# EAGLE design final (EAGLE 7.6.0)
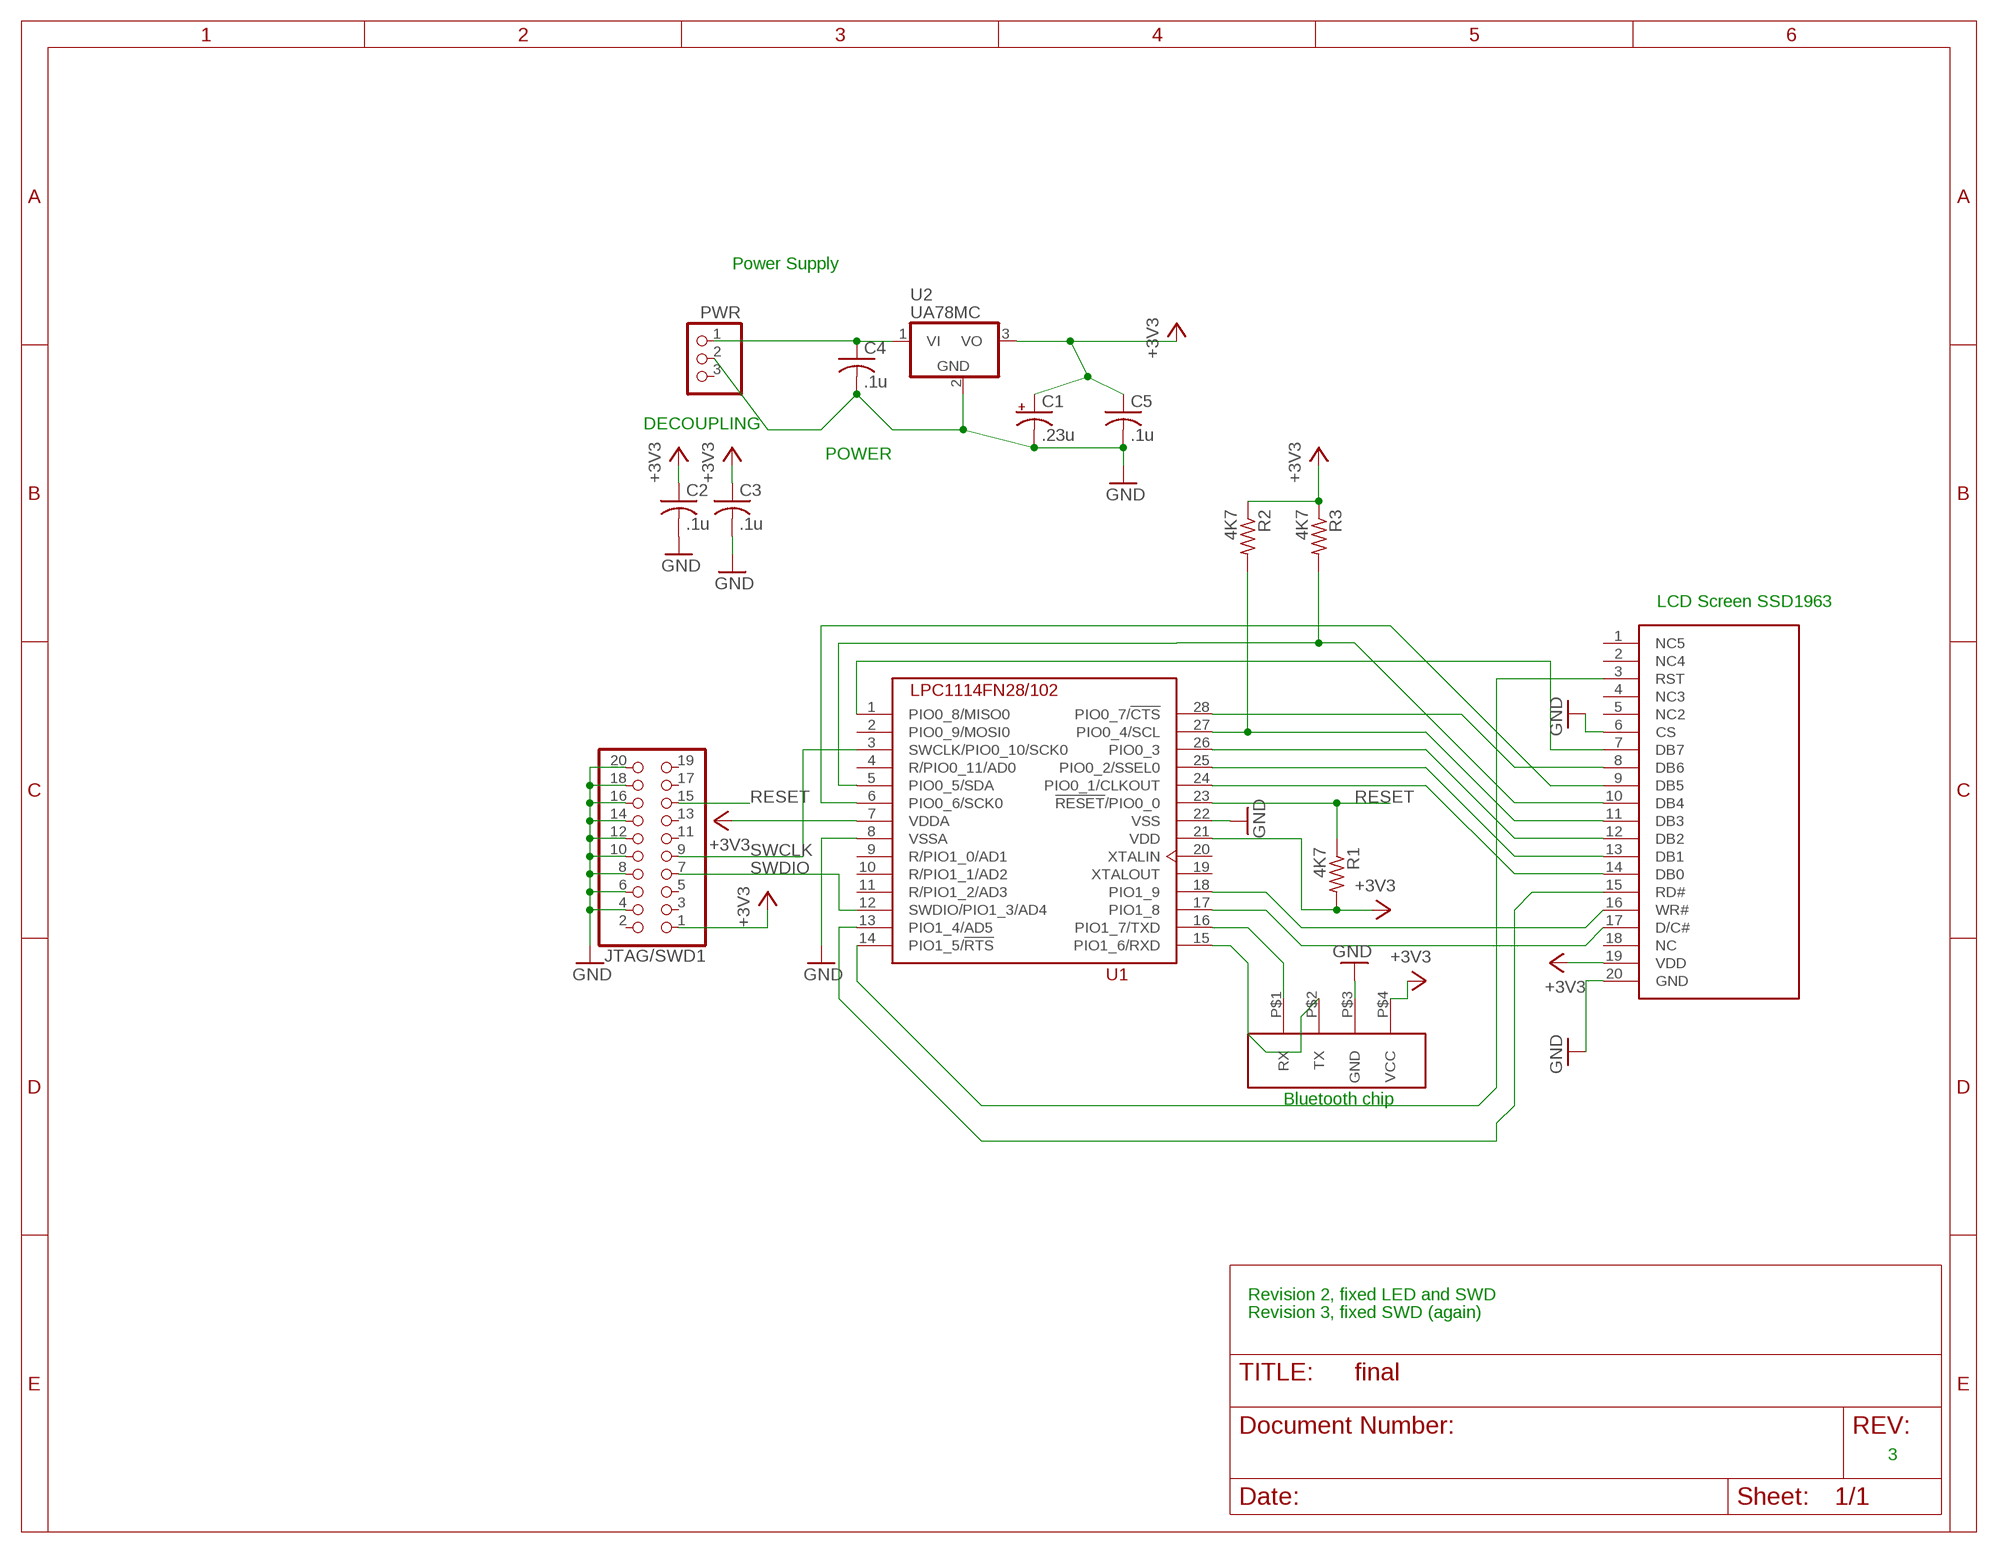
[diagram p0: schematic, sheet 1]

## Parts
C1  .23u  CPOL-USE3.5-8  [E3,5-8]
C2  .1u  C-US050-024X044  [C050-024X044]
C3  .1u  C-US050-024X044  [C050-024X044]
C4  .1u  C-US050-024X044  [C050-024X044]
C5  .1u  C-US050-024X044  [C050-024X044]
JTAG/SWD1  PINHD-2X10  [2X10]
PWR  PINHD-1X3  [1X03]
R1  4K7  R-US_0207/10  [0207/10]
R2  4K7  R-US_0207/10  [0207/10]
R3  4K7  R-US_0207/10  [0207/10]
U1  LPC1114FN28/102  [DIL28-6]
U2  UA78MC  [TO220V]
U$1  BLUETOOTH  [BLUETOOTH]
U$2  LCD_TOUCH  [NHD-7.0-800480WF]

## Nets
+3V3: C1.+ C2.1 C3.1 C5.1 JTAG/SWD1.1 R1.2 R2.1 R3.1 U1.7(VDDA) U1.21(VDD) U2.3(VO) U$1.P$4(VCC) U$2.19(VDD)
GND: C1.- C2.2 C3.2 C4.2 C5.2 JTAG/SWD1.4 JTAG/SWD1.6 JTAG/SWD1.8 JTAG/SWD1.10 JTAG/SWD1.12 JTAG/SWD1.14 JTAG/SWD1.16 JTAG/SWD1.18 JTAG/SWD1.20 PWR.2 U1.8(VSSA) U1.22(VSS) U2.2(GND) U$1.P$3(GND) U$2.6(CS) U$2.20(GND)
N$1: U1.5(PIO0_5/SDA)
N$2: C4.1 PWR.1 U2.1(VI)
N$3: U1.6(PIO0_6/SCK0) U$2.9(DB5)
N$4: U1.1(PIO0_8/MISO0) U$2.7(DB7)
N$5: U1.16(PIO1_7/TXD) U$1.P$1(RX)
N$6: U1.13(PIO1_4/AD5) U$2.15(RD#)
N$7: U1.15(PIO1_6/RXD) U$1.P$2(TX)
N$8: R3.2 U$2.10(DB4)
N$9: R2.2 U1.27(PIO0_4/SCL) U$2.11(DB3)
N$10: U1.26(PIO0_3) U$2.12(DB2)
N$11: U1.25(PIO0_2/SSEL0) U$2.13(DB1)
N$12: U1.24(PIO0_1/CLKOUT) U$2.14(DB0)
N$13: U1.28(PIO0_7/!CTS) U$2.8(DB6)
N$14: U1.14(PIO1_5/!RTS) U$2.3(RST)
N$17: U1.17(PIO1_8) U$2.17(D/C#)
N$18: U1.18(PIO1_9) U$2.16(WR#)
RESET: JTAG/SWD1.15 R1.1 U1.23(!RESET!/PIO0_0)
SWCLK: JTAG/SWD1.9 U1.3(SWCLK/PIO0_10/SCK0)
SWDIO: JTAG/SWD1.7 U1.12(SWDIO/PIO1_3/AD4)
Unconnected: JTAG/SWD1.2 JTAG/SWD1.3 JTAG/SWD1.5 JTAG/SWD1.11 JTAG/SWD1.13 JTAG/SWD1.17 JTAG/SWD1.19 PWR.3 U1.2(PIO0_9/MOSI0) U1.4(R/PIO0_11/AD0) U1.9(R/PIO1_0/AD1) U1.10(R/PIO1_1/AD2) U1.11(R/PIO1_2/AD3) U1.19(XTALOUT) U1.20(XTALIN) U$2.1(NC5) U$2.2(NC4) U$2.4(NC3) U$2.5(NC2) U$2.18(NC)

## Notes on the sheet
- Power Supply
- DECOUPLING
- POWER
- LCD Screen SSD1963
- Bluetooth chip
- Revision 2, fixed LED and SWD
- Revision 3, fixed SWD (again)
- 3

## Library data of the parts
C1 = rcl:CPOL-US: POLARIZED CAPACITOR, American symbol
C2-C5 = rcl:C-US: CAPACITOR, American symbol
JTAG/SWD1 = pinhead:PINHD-2X10: PIN HEADER
PWR = pinhead:PINHD-1X3: PIN HEADER
R1-R3 = rcl:R-US_: RESISTOR, American symbol
U1 = lpc_11xx:LPC1114FN28/102
U2 = lpc_11xx:UA78M*C
U$1 = bluetooth:BLUETOOTH
U$2 = lcd_touch:LCD_TOUCH

## Board
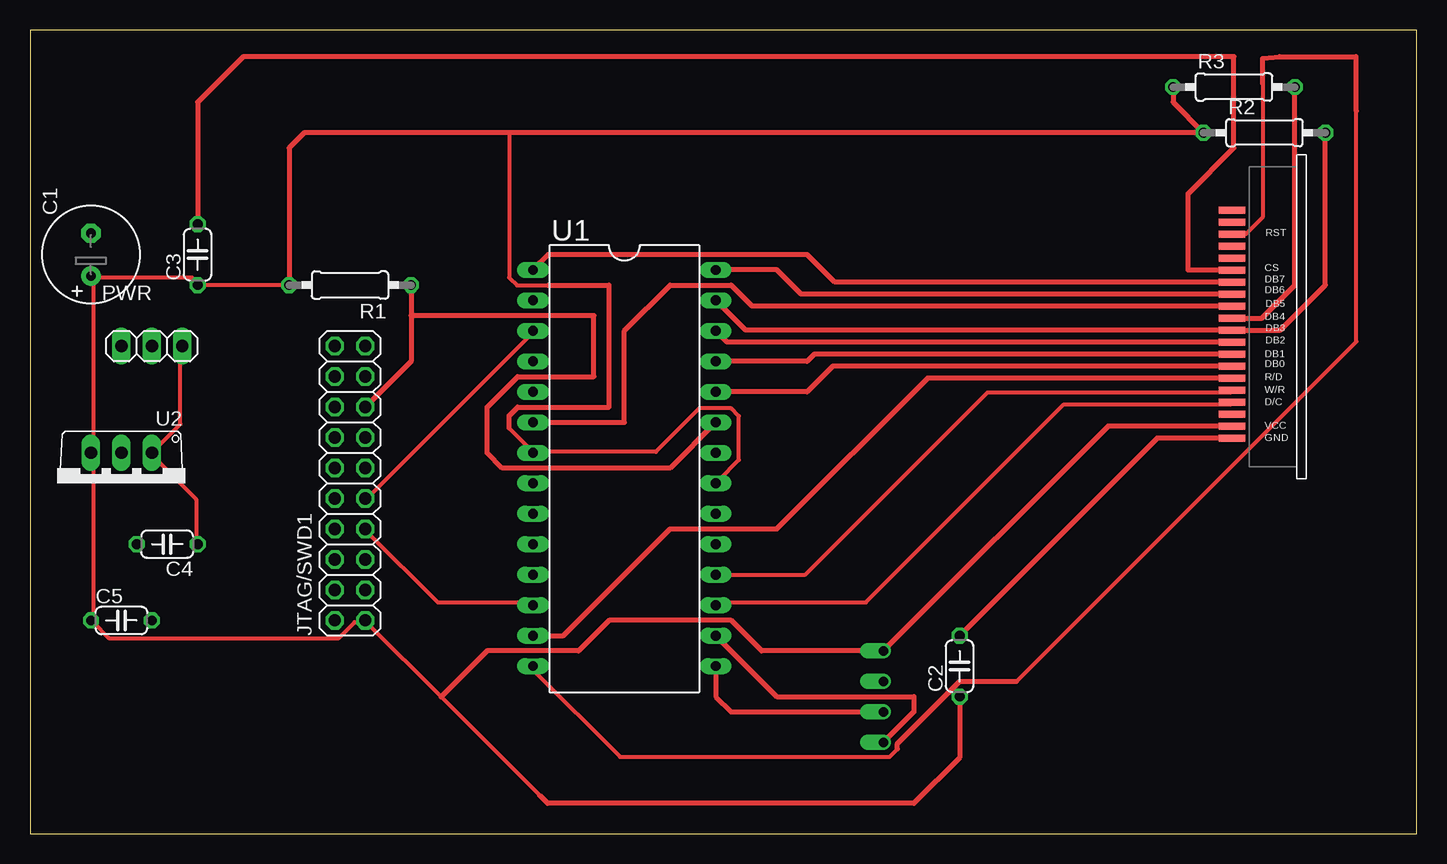
[diagram p1: board, top side]
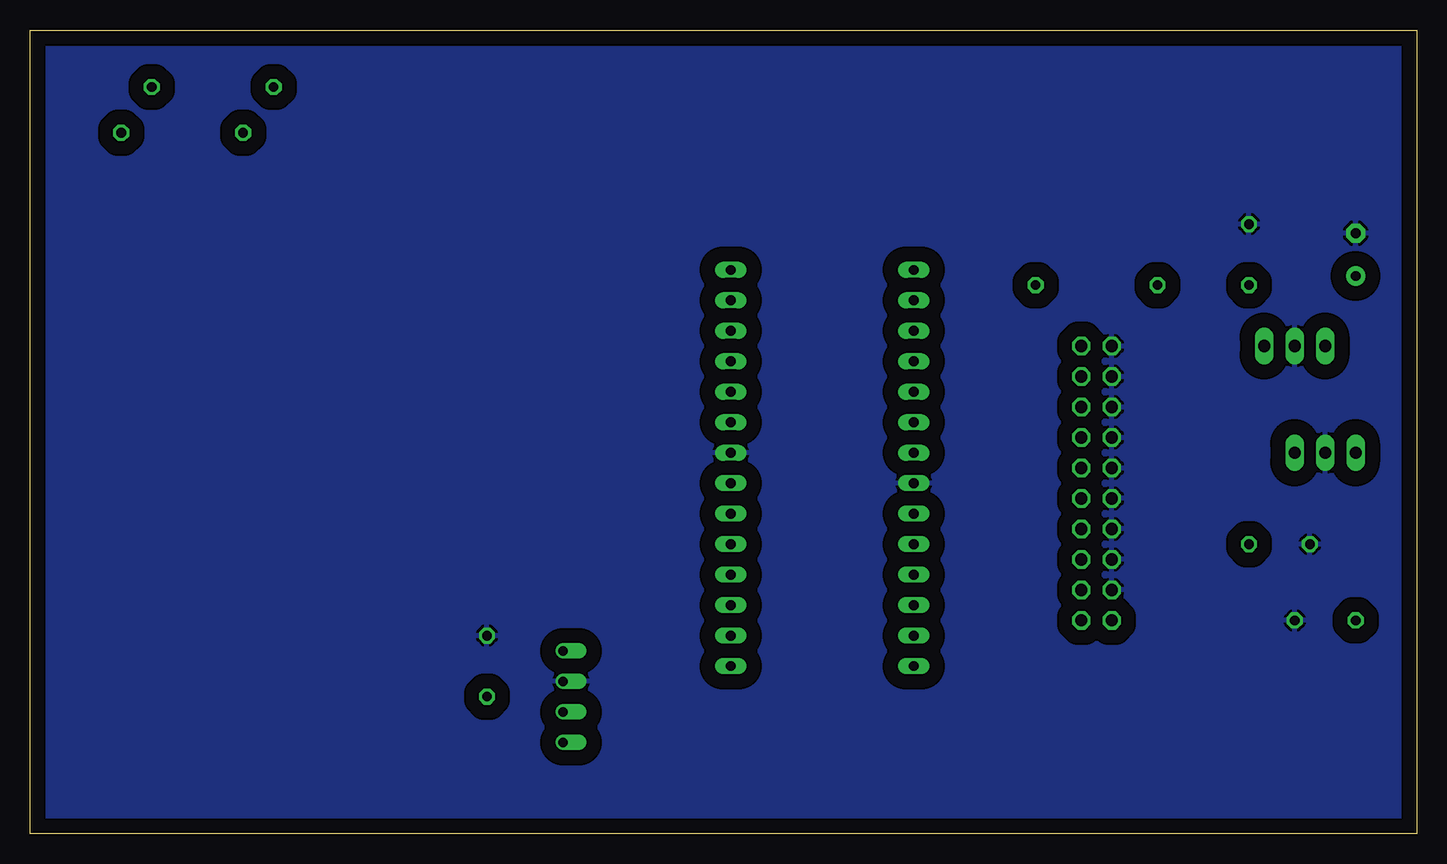
[diagram p2: board, bottom side, seen from below]

Size 115.55 x 66.98 mm. Coordinates in mm from the lower left corner, seen from the top.
Outline: 0,0 115.55,0 115.55,66.98 0,66.98 0,0
Copper layers (1*16): Top 0.035mm / dielectric 1.5mm / Bottom 0.035mm
Design rules "MWSEagleDesignRules2": minimum track width 13mil, minimum drill 22mil, track to track 13mil, track to pad 13mil, pad to pad 13mil, via to via 13mil, smd to smd 8mil, copper to edge 40mil, drill to drill 8mil, minimum pad ring 10mil, minimum via ring 8mil, stop-mask expansion 4mil, vias tented up to drill 0mil, thermal gap 10mil

### Footprints (pad centres in the part's own frame; a part is rotated, then mirrored left to right if it is on the bottom)
E3,5-8 = drill 0.813 pad 1.6: + -1.778,0 | drill 0.813 pad 1.6 octagon: - 1.778,0
C050-024X044 = drill 0.813 octagon: 1 -2.54,0; 2 2.54,0
2X10 = drill 1.016 octagon: 1 -11.43,-1.27; 2 -11.43,1.27; 3 -8.89,-1.27; 4 -8.89,1.27; 5 -6.35,-1.27; 6 -6.35,1.27; 7 -3.81,-1.27; 8 -3.81,1.27; 9 -1.27,-1.27; 10 -1.27,1.27; 11 1.27,-1.27; 12 1.27,1.27; 13 3.81,-1.27; 14 3.81,1.27; 15 6.35,-1.27; 16 6.35,1.27; 17 8.89,-1.27; 18 8.89,1.27; 19 11.43,-1.27; 20 11.43,1.27
1X03 = drill 1.016 long: 1 -2.54,0; 2 0,0; 3 2.54,0
0207/10 = drill 0.813 octagon: 1 -5.08,0; 2 5.08,0
DIL28-6 = drill 0.813 long: 1 -16.51,-7.62; 2 -13.97,-7.62; 3 -11.43,-7.62; 4 -8.89,-7.62; 5 -6.35,-7.62; 6 -3.81,-7.62; 7 -1.27,-7.62; 8 1.27,-7.62; 9 3.81,-7.62; 10 6.35,-7.62; 11 8.89,-7.62; 12 11.43,-7.62; 13 13.97,-7.62; 14 16.51,-7.62; 15 16.51,7.62; 16 13.97,7.62; 17 11.43,7.62; 18 8.89,7.62; 19 6.35,7.62; 20 3.81,7.62; 21 1.27,7.62; 22 -1.27,7.62; 23 -3.81,7.62; 24 -6.35,7.62; 25 -8.89,7.62; 26 -11.43,7.62; 27 -13.97,7.62; 28 -16.51,7.62
TO220V = drill 1.016 long: 1 -2.54,-2.54; 2 0,-2.54; 3 2.54,-2.54
BLUETOOTH = drill 0.8 offset: P$1 -5.08,2.54; P$2 -2.54,2.54; P$3 0,2.54; P$4 2.54,2.54
NHD-7.0-800480WF = smd 2.2 x 0.6: 1 9.99,7.515; 2 9.99,6.515; 3 9.99,5.515; 4 9.99,4.515; 5 9.99,3.515; 6 9.99,2.515; 7 9.99,1.515; 8 9.99,0.515; 9 9.99,-0.485; 10 9.99,-1.485; 11 9.99,-2.485; 12 9.99,-3.485; 13 9.99,-4.485; 14 9.99,-5.485; 15 9.99,-6.485; 16 9.99,-7.485; 17 9.99,-8.485; 18 9.99,-9.485; 19 9.99,-10.485; 20 9.99,-11.485

### Placement (x,y rotation side)
C1  5.08,48.26 90 top
C2  77.47,13.97 90 top
C3  13.97,48.26 90 top
C4  11.43,24.13 180 top
C5  7.62,17.78 0 top
JTAG/SWD1  26.67,29.21 90 top
PWR  10.16,40.64 180 top
R1  26.67,45.72 180 top
R2  102.87,58.42 0 top
R3  100.33,62.23 0 top
U1  49.53,30.48 270 top
U2  7.62,29.21 180 top
U$1  68.58,12.7 90 bottom
U$2  90.17,44.45 0 top

### Tracks (layer width: path | path; a pad name or v marks a point on that pad's centre or on a via)
+3V3
  Top 0.33: 42.47,3.2 34.27,11.41 28.04,17.63 JTAG/SWD1.1 27.71,17.63 27.05,17.63 25.73,16.31 6.58,16.31 5.26,17.63 C5.1 5.26,17.96 5.26,31.5 U2.3 5.26,31.83 5.26,46.35 | 41.91,31.83 52.15,31.83 55.78,35.46 58.42,35.46 59.08,34.8 59.08,31.17 57.43,29.52 U1.21 | 21.59,45.7 14.17,45.7 C3.1 13.84,46.02 13.51,46.35 5.26,46.35 | 5.26,46.35 C1.+ | 39.93,33.81 41.91,31.83 | 43.23,45.7 43.18,45.7 40.59,45.7 39.93,46.35 39.93,58.42 | 41.91,31.83 U1.7
  Top 0.406: R3.1 95.25,60.96 R2.1 39.93,58.42 22.86,58.42 21.59,57.15 R1.2 21.59,45.7 | U$2.19 89.84,33.97 U$1.P$4 60.96,15.24 58.42,17.78 48.26,17.78 45.72,15.24 38.1,15.24 34.27,11.41 | C2.1 77.47,6.35 73.66,2.54 43.13,2.54 42.47,3.2 | 39.93,33.81 39.93,34.85 40.64,35.56 48.26,35.56 48.26,45.72 48.23,45.7 43.23,45.7 | 43.2,45.72 43.18,45.7
GND
  Top 0.406: U$2.20 93.93,32.97 C2.2 | U$2.6 96.54,46.96 96.52,46.99 96.52,53.34 100.33,57.15 100.33,64.77 17.78,64.77 13.97,60.96 C3.2
  pour Bottom (isolate 1.27): 0,66.04 115.57,66.04 115.57,0 0,0
N$2
  Top 0.33: C4.1 13.84,24.23 13.84,27.86 10.21,31.5 U2.1 10.21,31.83 12.52,34.14 12.52,40.41 PWR.1
N$3
  Top 0.406: U$2.9 60.17,43.96 58.42,45.72 53.34,45.72 49.53,41.91 49.53,34.29 U1.6
N$4
  Top 0.406: U$2.7 67.06,45.96 64.77,48.26 43.18,48.26 U1.1
N$5
  Top 0.406: U1.16 62.23,11.43 73.66,11.43 73.66,10.16 U$1.P$1
N$6
  Top 0.406: U$2.15 74.8,37.96 62.23,25.4 53.34,25.4 44.45,16.51 U1.13
N$7
  Top 0.406: U1.15 57.15,11.43 58.42,10.16 U$1.P$2
N$8
  Top 0.406: U$2.10 102.66,42.96 105.41,45.72 R3.2
N$9
  Top 0.406: R2.2 107.95,45.72 104.19,41.96 U$2.11 59.63,41.96 U1.27
N$10
  Top 0.406: U$2.12 58.09,40.96 U1.26
N$11
  Top 0.406: U$2.13 65.37,39.96 64.77,39.37 U1.25
N$12
  Top 0.406: U$2.14 66.91,38.96 64.77,36.83 U1.24
N$13
  Top 0.406: U$2.8 64.25,44.96 62.23,46.99 U1.28
N$14
  Top 0.33: 102.72,62.53 102.72,51.36 101.35,49.99 100.35,49.99 U$2.3 | 110.54,60.22 110.54,41.02 82.19,12.68 | 72.29,7.06 71.63,6.4 49.17,6.4 41.91,13.67 U1.14
  Top 0.406: 102.72,62.53 102.72,64.62 104.14,64.77 110.49,64.77 110.49,60.27 110.54,60.22 | 72.29,7.06 72.29,7.52 77.47,12.7 82.17,12.7 82.19,12.68
N$17
  Top 0.33: U$2.17 100.03,35.79 86.16,35.79 69.65,19.28 57.43,19.28 U1.17
N$18
  Top 0.33: U1.18 64.62,21.59 79.81,36.78 100.03,36.78 U$2.16
RESET
  Top 0.406: R1.1 31.75,43.18 | 31.75,43.18 31.75,39.37 JTAG/SWD1.15 | U1.23 53.34,30.48 39.37,30.48 38.1,31.75 38.1,35.56 40.64,38.1 46.99,38.1 46.99,43.18 31.75,43.18
SWCLK
  Top 0.33: U1.3 41.91,41.73 28.04,27.86 JTAG/SWD1.9
SWDIO
  Top 0.33: U1.12 41.91,19.28 33.98,19.28 28.04,25.22 JTAG/SWD1.7